# Altium schematic sheet 21_Peripherals.SchDoc: Peripherals
size A3; Organization: Lime Microsystems; Address1: Surrey Tech Centre; Address2: Guildford GU2 7YG; Address3: Surray; Address4: United Kingdom; Revision: v1.1; SheetNumber: 21; SheetTotal: 31
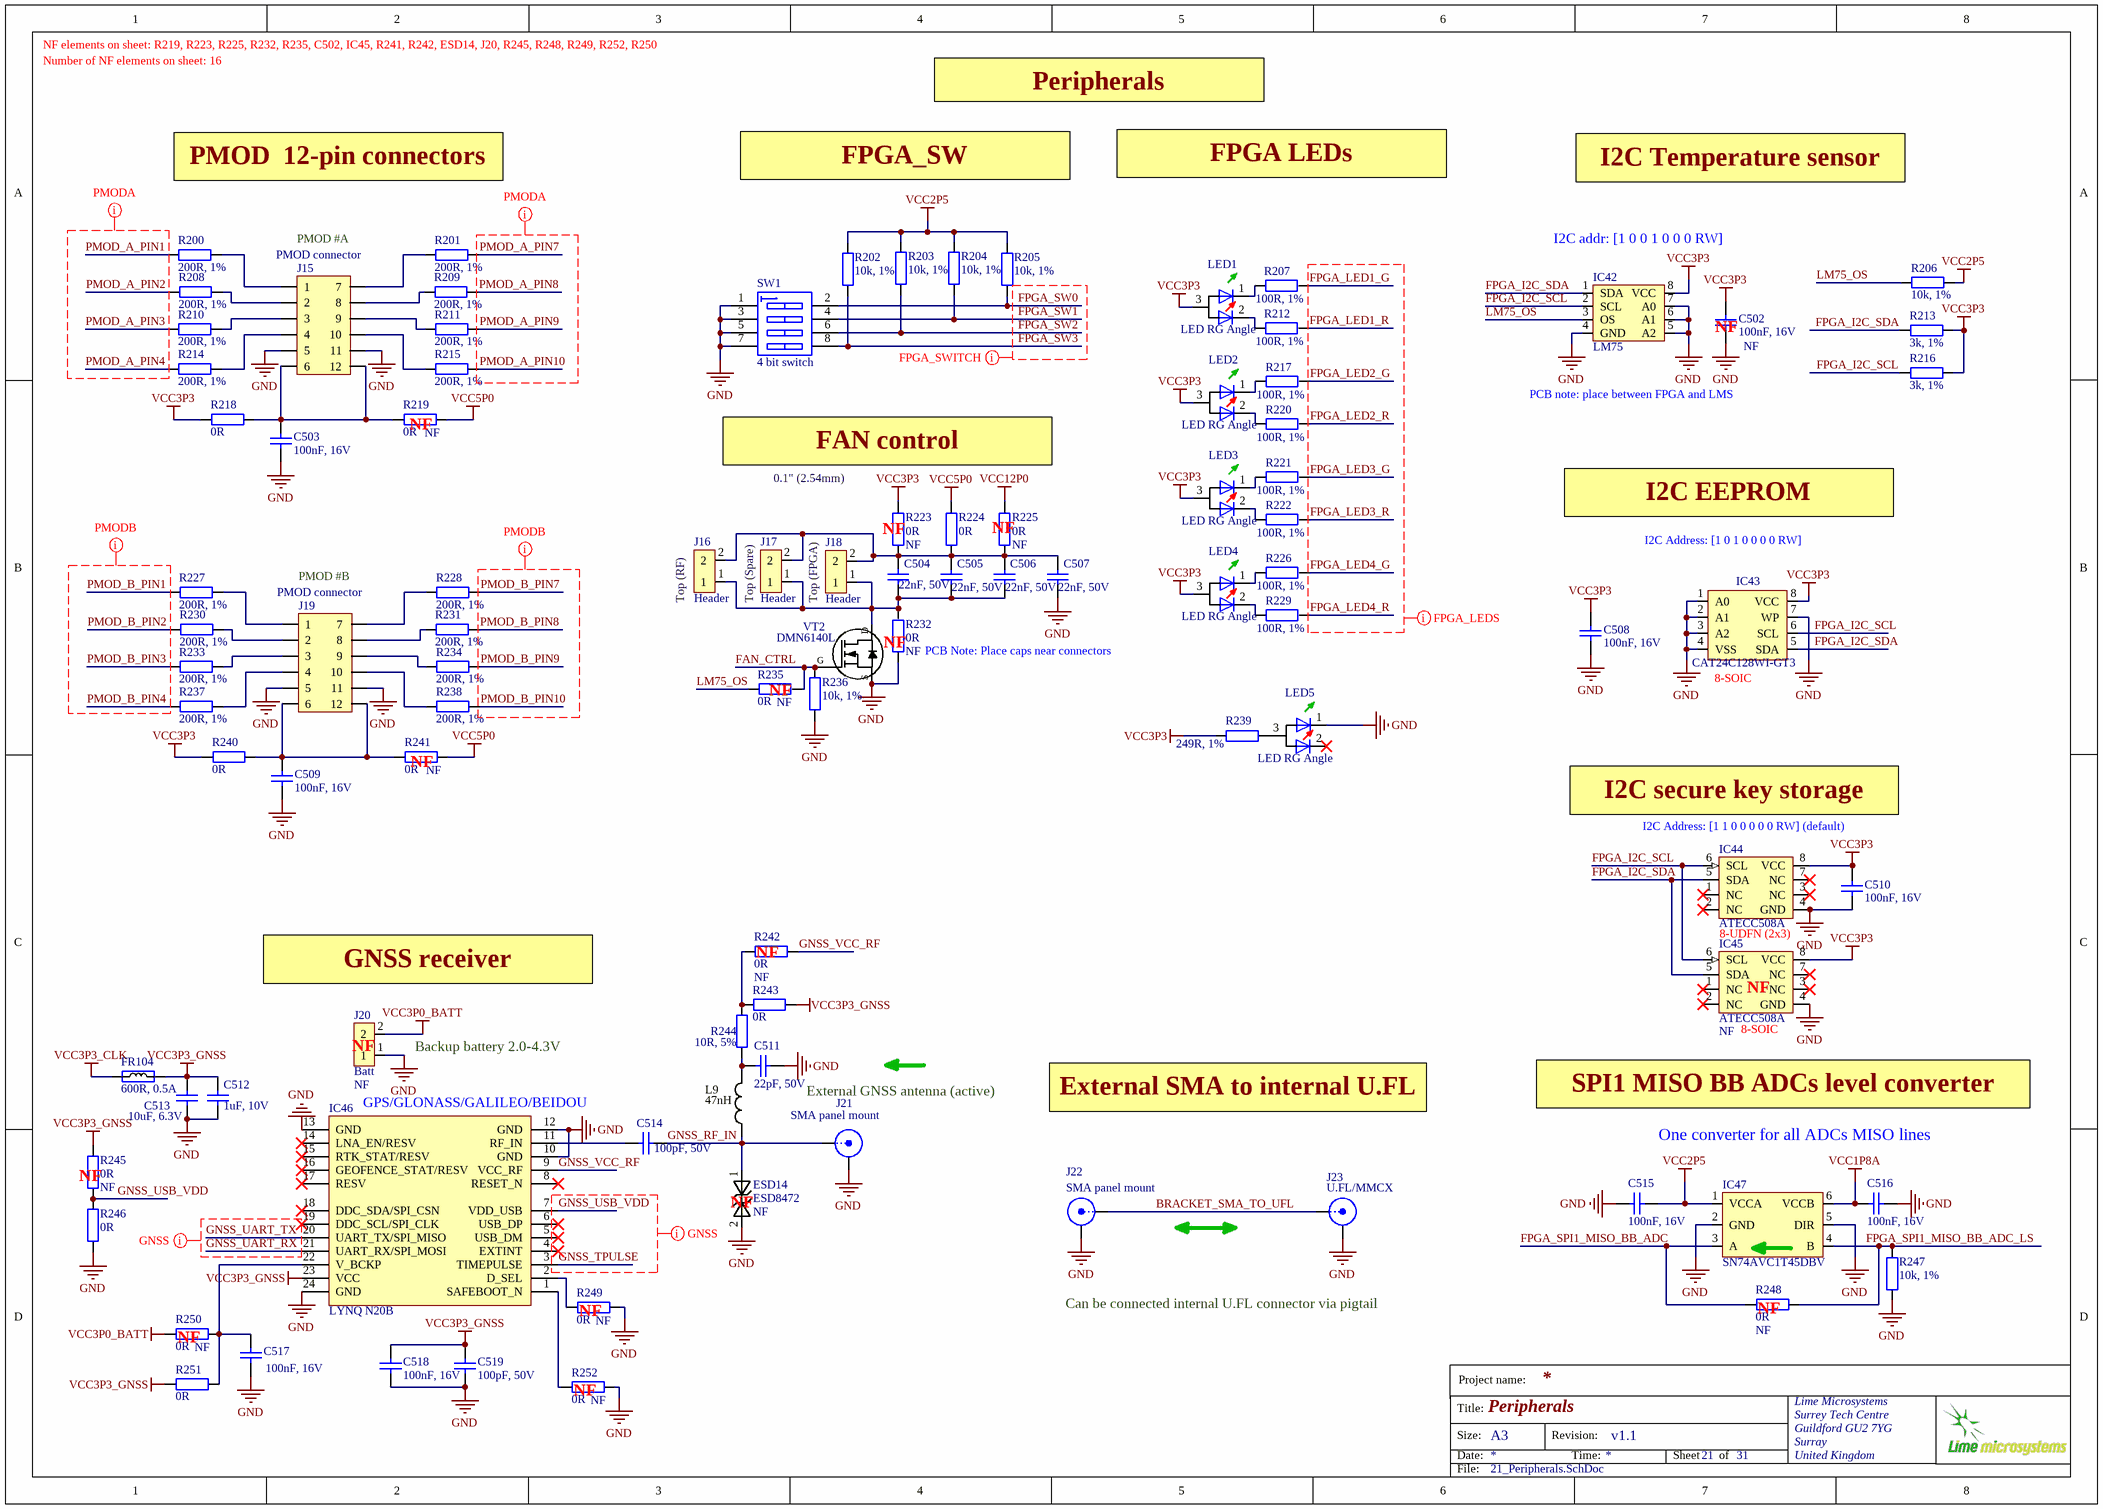
[diagram p0: 21_Peripherals.SchDoc]

## Parts
C502  100nF, 16V  Assembly Info: NF  [CAP0402]
C503  100nF, 16V  [CAP0402]
C504  22nF, 50V  [CAP0402]
C505  22nF, 50V  [CAP0402]
C506  22nF, 50V  [CAP0402]
C507  22nF, 50V  [CAP0402]
C508  100nF, 16V  [CAP0402]
C509  100nF, 16V  [CAP0402]
C510  100nF, 16V  [CAP0402]
C511  22pF, 50V  [CAP0402]
C512  1uF, 10V  [CAP0402]
C513  10uF, 6.3V  [CAP0603]
C514  100pF, 50V  [CAP0402]
C515  100nF, 16V  [CAP0402]
C516  100nF, 16V  [CAP0402]
C517  100nF, 16V  [CAP0402]
C518  100nF, 16V  [CAP0402]
C519  100pF, 50V  [CAP0402]
ESD14  ESD8472  Assembly Info: NF  [ESD8472_X3DFN2]
FR104  value 600R, 0.5A  [RES0402]  (hidden comment: Ferrite)
IC42  LM75  [HWSON8_LM75]
IC43  CAT24C128WI-GT3  [SOIC127P600-8DL_v2]
IC44  ATECC508A  [ATECC508A_UDFN8]
IC45  ATECC508A  Assembly Info: NF  [SOIC127P600-8DL_v2]
IC46  LYNQ N20B  [NEO-7M/8M]
IC47  SN74AVC1T45DBV  [SOT23-6]
J15  PMOD connector  [PMODconn_right_angle_TH]
J16  Header  [HDR_1x2]
J17  Header  [HDR_1x2]
J18  Header  [HDR_1x2]
J19  PMOD connector  [PMODconn_right_angle_TH]
J20  Batt  Assembly Info: NF  [HDR_1x2]
J21  SMA panel mount  [SMA_connector_side]
J22  SMA panel mount  [SMA_connector_side]
J23  U.FL/MMCX  [MMCX_UFL_conn_u]
L9  47nH  [RES0402]
LED1  LED RG Angle  [LED_RG_RIGHT_ANGLE_v3]
LED2  LED RG Angle  [LED_RG_RIGHT_ANGLE_v3]
LED3  LED RG Angle  [LED_RG_RIGHT_ANGLE_v3]
LED4  LED RG Angle  [LED_RG_RIGHT_ANGLE_v3]
LED5  LED RG Angle  [LED_RG_RIGHT_ANGLE_v3]
R200  200R, 1%  [RES0402]
R201  200R, 1%  [RES0402]
R202  10k, 1%  [RES0402]
R203  10k, 1%  [RES0402]
R204  10k, 1%  [RES0402]
R205  10k, 1%  [RES0402]
R206  10k, 1%  [RES0402]
R207  100R, 1%  [RES0402]
R208  200R, 1%  [RES0402]
R209  200R, 1%  [RES0402]
R210  200R, 1%  [RES0402]
R211  200R, 1%  [RES0402]
R212  100R, 1%  [RES0402]
R213  3k, 1%  [RES0402]
R214  200R, 1%  [RES0402]
R215  200R, 1%  [RES0402]
R216  3k, 1%  [RES0402]
R217  100R, 1%  [RES0402]
R218  0R  [RES0402]
R219  0R  Assembly Info: NF  [RES0402]
R220  100R, 1%  [RES0402]
R221  100R, 1%  [RES0402]
R222  100R, 1%  [RES0402]
R223  0R  Assembly Info: NF  [RES0402]
R224  0R  [RES0402]
R225  0R  Assembly Info: NF  [RES0402]
R226  100R, 1%  [RES0402]
R227  200R, 1%  [RES0402]
R228  200R, 1%  [RES0402]
R229  100R, 1%  [RES0402]
R230  200R, 1%  [RES0402]
R231  200R, 1%  [RES0402]
R232  0R  Assembly Info: NF  [RES0402]
R233  200R, 1%  [RES0402]
R234  200R, 1%  [RES0402]
R235  0R  Assembly Info: NF  [RES0402]
R236  10k, 1%  [RES0402]
R237  200R, 1%  [RES0402]
R238  200R, 1%  [RES0402]
R239  249R, 1%  [RES0402]
R240  0R  [RES0402]
R241  0R  Assembly Info: NF  [RES0402]
R242  0R  Assembly Info: NF  [RES0402]
R243  0R  [RES0402]
R244  10R, 5%  [RES0402]
R245  0R  Assembly Info: NF  [RES0402]
R246  0R  [RES0402]
R247  10k, 1%  [RES0402]
R248  0R  Assembly Info: NF  [RES0402]
R249  0R  Assembly Info: NF  [RES0402]
R250  0R  Assembly Info: NF  [RES0402]
R251  0R  [RES0402]
R252  0R  Assembly Info: NF  [RES0402]
SW1  4 bit switch  [DS02C-254-1L-04BE_DIP_SWITCH_4PIN]
VT2  DMN6140L  [SOT23-3]

## Nets
GND: C502.2 C503.2 C507.2 C508.2 C509.2 C510.2 C511.1 C512.1 C513.1 C515.1 C516.2 C517.2 C518.1 C519.2 ESD14.2 IC42.4(GND) IC42.5(A2) IC42.6(A1) IC42.7(A0) IC43.1(A0) IC43.2(A1) IC43.3(A2) IC43.4(VSS) IC43.7(WP) IC44.4(GND) IC45.4(GND) IC46.10(GND) IC46.12(GND) IC46.13(GND) IC46.24(GND) IC47.2(GND) IC47.5(DIR) J15.5 J15.11 J19.5 J19.11 J20.1 J21.2(Y) J22.2(Y) J23.2(Y) LED5.1(C1) R232.1 R236.2 R246.2 R247.1 R249.1 R252.1 SW1.1(A1) SW1.3(A2) SW1.5(A3) SW1.7(A4) VT2.S
VCC1P8A: C516.1 IC47.6(VCCB)
VCC2P5: C515.2 IC47.1(VCCA) R202.1 R203.1 R204.1 R205.1 R206.2
VCC3P0_BATT: J20.2 R250.2
VCC3P3: C502.1 C508.1 C510.1 IC42.8(VCC) IC43.8(VCC) IC44.8(VCC) IC45.8(VCC) LED1.3(A) LED2.3(A) LED3.3(A) LED4.3(A) R213.1 R216.1 R218.2 R223.2 R239.1 R240.2
VCC3P3_CLK: FR104.1
VCC3P3_GNSS: C512.2 C513.2 C518.2 C519.1 FR104.2 IC46.23(VCC) R243.1 R245.2 R251.2
VCC5P0: R219.1 R224.2 R241.1
VCC12P0: R225.2
BRACKET_SMA_TO_UFL: J22.1(X) J23.1(X)
FAN_CTRL: R235.2 R236.1 VT2.G
FPGA_I2C_SCL: IC42.2(SCL) IC43.6(SCL) IC44.6(SCL) IC45.6(SCL) R216.2
FPGA_I2C_SDA: IC42.1(SDA) IC43.5(SDA) IC44.5(SDA) IC45.5(SDA) R213.2
FPGA_LED1_G: R207.2
FPGA_LED1_R: R212.2
FPGA_LED2_G: R217.2
FPGA_LED2_R: R220.2
FPGA_LED3_G: R221.2
FPGA_LED3_R: R222.2
FPGA_LED4_G: R226.2
FPGA_LED4_R: R229.2
FPGA_SPI1_MISO_BB_ADC: IC47.3(A) R248.2
FPGA_SPI1_MISO_BB_ADC_LS: IC47.4(B) R247.2 R248.1
FPGA_SW0: R205.2 SW1.2(B1)
FPGA_SW1: R204.2 SW1.4(B2)
FPGA_SW2: R203.2 SW1.6(B3)
FPGA_SW3: R202.2 SW1.8(B4)
GNSS_RF_IN: C514.1 ESD14.1 J21.1(X) L9.1
GNSS_TPULSE: IC46.3(TIMEPULSE)
GNSS_UART_RX: IC46.21(UART_RX/SPI_MOSI)
GNSS_UART_TX: IC46.20(UART_TX/SPI_MISO)
GNSS_USB_VDD: IC46.7(VDD_USB) R245.1 R246.1
GNSS_VCC_RF: IC46.9(VCC_RF) R242.2
LM75_OS: IC42.3(OS) R206.1 R235.1
PMOD_A_PIN1: R200.1
PMOD_A_PIN2: R208.1
PMOD_A_PIN3: R210.1
PMOD_A_PIN4: R214.1
PMOD_A_PIN7: R201.2
PMOD_A_PIN8: R209.2
PMOD_A_PIN9: R211.2
PMOD_A_PIN10: R215.2
PMOD_B_PIN1: R227.1
PMOD_B_PIN2: R230.1
PMOD_B_PIN3: R233.1
PMOD_B_PIN4: R237.1
PMOD_B_PIN7: R228.2
PMOD_B_PIN8: R231.2
PMOD_B_PIN9: R234.2
PMOD_B_PIN10: R238.2
NetC503_1: C503.1 J15.6 J15.12 R218.1 R219.2
NetC504_1: C504.1 C505.1 C506.1 C507.1 J16.2 J17.2 J18.2 R223.1 R224.1 R225.1
NetC504_2: C504.2 C505.2 C506.2 J16.1 J17.1 J18.1 R232.2 VT2.D
NetC509_1: C509.1 J19.6 J19.12 R240.1 R241.2
NetC511_2: C511.2 L9.2 R244.2
NetC514_2: C514.2 IC46.11(RF_IN)
NetC517_1: C517.1 IC46.22(V_BCKP) R250.1 R251.1
NetIC46_1: IC46.1(SAFEBOOT_N) R252.2
NetIC46_2: IC46.2(D_SEL) R249.2
NetJ15_1: J15.1 R200.2
NetJ15_2: J15.2 R208.2
NetJ15_3: J15.3 R210.2
NetJ15_4: J15.4 R214.2
NetJ15_7: J15.7 R201.1
NetJ15_8: J15.8 R209.1
NetJ15_9: J15.9 R211.1
NetJ15_10: J15.10 R215.1
NetJ19_1: J19.1 R227.2
NetJ19_2: J19.2 R230.2
NetJ19_3: J19.3 R233.2
NetJ19_4: J19.4 R237.2
NetJ19_7: J19.7 R228.1
NetJ19_8: J19.8 R231.1
NetJ19_9: J19.9 R234.1
NetJ19_10: J19.10 R238.1
NetLED1_1: LED1.1(C1) R207.1
NetLED1_2: LED1.2(C2) R212.1
NetLED2_1: LED2.1(C1) R217.1
NetLED2_2: LED2.2(C2) R220.1
NetLED3_1: LED3.1(C1) R221.1
NetLED3_2: LED3.2(C2) R222.1
NetLED4_1: LED4.1(C1) R226.1
NetLED4_2: LED4.2(C2) R229.1
NetLED5_3: LED5.3(A) R239.2
NetR242_1: R242.1 R243.2 R244.1

Not connected (* = marked no-connect by the designer): IC44 1(NC)* 2(NC)* 3(NC)* 7(NC)*; IC45 1(NC)* 2(NC)* 3(NC)* 7(NC)*; IC46 4(EXTINT)* 5(USB_DM)* 6(USB_DP)* 8(RESET_N)* 14(LNA_EN/RESV)* 15(RTK_STAT/RESV)* 16(GEOFENCE_STAT/RESV)* 17(RESV)* 18(DDC_SDA/SPI_CSN)* 19(DDC_SCL/SPI_CLK)*; LED5 2(C2)*

## Layout directives
net class FPGA_LEDS: FPGA_LED1_G, FPGA_LED1_R, FPGA_LED2_G, FPGA_LED2_R, FPGA_LED3_G, FPGA_LED3_R, FPGA_LED4_G, FPGA_LED4_R
net class GNSS: GNSS_TPULSE, GNSS_UART_RX, GNSS_UART_TX, GNSS_USB_VDD
net class FPGA_SWITCH: FPGA_SW0, FPGA_SW1, FPGA_SW2, FPGA_SW3
net class PMODB: PMOD_B_PIN1, PMOD_B_PIN2, PMOD_B_PIN3, PMOD_B_PIN4, PMOD_B_PIN7, PMOD_B_PIN8, PMOD_B_PIN9, PMOD_B_PIN10
net class PMODA: PMOD_A_PIN1, PMOD_A_PIN2, PMOD_A_PIN3, PMOD_A_PIN4, PMOD_A_PIN7, PMOD_A_PIN8, PMOD_A_PIN9, PMOD_A_PIN10

## Notes on the sheet
- Number of NF elements on sheet: 16
- NF elements on sheet: R219, R223, R225, R232, R235, C502, IC45, R241, R242, ESD14, J20, R245, R248, R249, R252, R250
- Peripherals
- PMOD  12-pin connectors
- FPGA_SW
- FPGA LEDs
- I2C Temperature sensor
- (near J15) PMOD #A
- I2C addr: [1 0 0 1 0 0 0 RW]
- (near C502) NF
- (near R219) NF
- PCB note: place between FPGA and LMS
- FAN control
- 0.1" (2.54mm)
- I2C EEPROM
- (near J19) PMOD #B
- (near R223) NF
- (near R225) NF
- (near IC43) I2C Address: [1 0 1 0 0 0 0 RW]
- (near J16) Top (RF)
- Top (Spare)
- Top (FPGA)
- NF
- (near R232) PCB Note: Place caps near connectors
- (near R235) NF
- (near IC43) 8-SOIC
- (near R241) NF
- I2C secure key storage
- I2C Address: [1 1 0 0 0 0 0 RW] (default)
- (near J20) GNSS receiver
- (near R242) NF
- 8-UDFN (2x3)
- (near IC45) NF
- (near J20) NF
- (near J20) Backup battery 2.0-4.3V
- (near IC45) 8-SOIC
- (near IC46) GPS/GLONASS/GALILEO/BEIDOU
- External GNSS antenna (active)
- External SMA to internal U.FL
- SPI1 MISO BB ADCs level converter
- (near R245) NF
- One converter for all ADCs MISO lines
- (near ESD14) NF
- (near R249) NF
- Can be connected internal U.FL connector via pigtail
- (near R248) NF
- (near R250) NF
- (near R252) NF
- Project name:
- Title:
- Size:
- Date:
- A3
- Revision:
- Time:
- Sheet
- of
- File:

## Library data of the parts
C502 C503 C508-C510 C517 = Cap_0603: Manufacturer Part Number 1: GRM155R71C104KA88D; Part Description: 0.10µF ±10% 16V X7R Ceramic Capacitor -55°C ~ 125°C Surface Mount, MLCC 0402 (1005 Metric) 0.039" L x 0.020" W (1.00mm x 0.50mm); Brand: Murata Electronics; Tolerance: 10 %; Type: General Purpose MLCC; Capacitance: 0.1 uF; Temperature Coefficient / Code: +/- 15 %; Case Height: 0.5 mm; Case Length: 1 mm; Dielectric: X7R; Supplier 1: Mouser; Supplier Part Number 1: 81-GRM155R71C104KA88; Case Code - in: 0402; Manufacturer: Murata Electronics; Category: Multilayer Ceramic Capacitors MLCC - SMD/SMT; Voltage Rating DC: 16 V; Value: 100nF, 16V; Case Code - mm: 1005; Case Width: 0.5 mm; Maximum Operating Temperature: + 125 C; Minimum Operating Temperature: - 55 C; Minimum Order Quantity: 1; Operating Temperature Range: - 55 C to + 125 C; Package / Case: 0402 (1005 metric); Packaging: Reel; Product: General Type MLCCs; Product Category: Low & Medium Capacitance SMD Ceramic Chip Capacitors; Reeling: True; RoHS - Mouser: Y; RoHS: RoHS Compliant; Series: GRM; Standard Pack Qty: 10000; Termination Style: SMD/SMT
  C503 C509 C517: Manufacturer Part Number: GRM155R71C104KA88D
C504-C507 = Cap_0402: Manufacturer: Kemet; Manufacturer Part Number 1: C0402C223K5RACTU; Part Description: 0.022µF ±10% 50V Ceramic Capacitor X7R 0402 (1005 Metric); Temperature Coefficient: X7R; Tolerance: ±10%; Capacitance: 0.022µF; Value: 22nF, 50V; Supplier 1: Digi-Key; Supplier Part Number 1: 399-7780-1-ND; Ratings: -; Packaging: Cut Tape (CT); Category: Capacitors; Size / Dimension: 0.039" L x 0.020" W (1.00mm x 0.50mm); RoHS: RoHS Compliant; Operating Temperature: -55°C ~ 125°C; Mounting Type: Surface Mount, MLCC; Applications: General Purpose; Voltage - Rated: 50V; Thickness (Max): 0.022" (0.55mm); Features: -; Height - Seated (Max): -; Lead Style: -; Package / Case: 0402 (1005 Metric); Lead Spacing: -
C511 = Cap_0402: Manufacturer: Yageo; Manufacturer Part Number 1: CC0402JRNPO9BN220; Part Description: 22pF ±5% 50V C0G, NP0 Ceramic Capacitor -55°C ~ 125°C Surface Mount, MLCC 0402 (1005 Metric) 0.039" L x 0.020" W (1.00mm x 0.50mm); Tolerance: ±5%; Temperature Coefficient: C0G, NP0; Value: 22pF, 50V; Supplier 1: Digi-Key; Supplier Part Number 1: 311-1018-2-ND; Category: Capacitors; Voltage - Rated: 50V; Packaging: Tape & Reel (TR); RoHS: RoHS Compliant; Capacitance: 22pF; Operating Temperature: -55°C ~ 125°C; Mounting Type: Surface Mount, MLCC; Height - Seated (Max): -; Size / Dimension: 0.039" L x 0.020" W (1.00mm x 0.50mm); Ratings: -; Applications: General Purpose; Thickness (Max): 0.022" (0.55mm); Lead Spacing: -; Lead Style: -; Features: -; Package / Case: 0402 (1005 Metric)
C512 = Cap_0402: CAP CER 1UF 10V X5R 0402; Manufacturer: TDK; Part Description: 1µF ±10% 10V X5R Ceramic Capacitor -55°C ~ 85°C Surface Mount, MLCC 0402 (1005 Metric) 0.039" L x 0.020" W (1.00mm x 0.50mm); Manufacturer Part Number 1: C1005X5R1E105K050BC; Voltage Rating: 10; Capacitance: 1; Capacitance Tolerance: ± 10%; Ceramic Capacitor Case: 0402 [1005 Metric]; Dielectric Characteristic: X6; Product Range: TDK - C Series; Value: 1uF, 10V; Supplier 1: Digi-Key; Supplier Part Number 1: 445-9066-1-ND; RoHS: YES; MSL: -
C513 = Cap_0603: Manufacturer Part Number 1: CC0603MRX5R5BB106; Manufacturer: Yageo; Part Description: 10µF ±20% 6.3V X5R Ceramic Capacitor -55°C ~ 85°C Surface Mount, MLCC 0603 (1608 Metric) 0.063" L x 0.031" W (1.60mm x 0.80mm); Capacitance: 10µF; Tolerance: ±20%; Supplier 1: Digi-Key; Supplier Part Number 1: 311-1448-2-ND; Package / Case: 0603 (1608 Metric); Category: Capacitors; Voltage - Rated: 6.3V; Value: 10uF, 6.3V
C514 C519 = Cap_0402: Manufacturer Part Number 1: CC0402JRNPO9BN101; Manufacturer: Yageo; Part Description: 100pF ±5% 50V C0G, NP0 Ceramic Capacitor -55°C ~ 125°C Surface Mount, MLCC 0402 (1005 Metric) 0.039" L x 0.020" W (1.00mm x 0.50mm); Tolerance: ±5%; Temperature Coefficient: C0G, NP0; Value: 100pF, 50V; Capacitance: 100pF; Thickness (Max): 0.022" (0.55mm); Size / Dimension: 0.039" L x 0.020" W (1.00mm x 0.50mm); RoHS: RoHS Compliant; Ratings: -; Package / Case: 0402 (1005 Metric); Mounting Type: Surface Mount, MLCC; Height - Seated (Max): -; Features: -; Lead Spacing: -; Voltage - Rated: 50V; Operating Temperature: -55°C ~ 125°C; Packaging: Cut Tape (CT); Applications: General Purpose; Lead Style: -; Supplier 1: Digi-Key; Category: Capacitors; Supplier Part Number 1: 311-1024-1-ND
C515 C516 = Cap_0603: Part Description: 0.10µF ±10% 16V X7R Ceramic Capacitor -55°C ~ 125°C Surface Mount, MLCC 0402 (1005 Metric) 0.039" L x 0.020" W (1.00mm x 0.50mm); Manufacturer Part Number 1: GRM155R71C104KA88D; Brand: Murata Electronics; Tolerance: 10 %; Type: General Purpose MLCC; Capacitance: 0.1 uF; Temperature Coefficient / Code: +/- 15 %; Case Height: 0.5 mm; Case Length: 1 mm; Dielectric: X7R; Supplier 1: Mouser; Supplier Part Number 1: 81-GRM155R71C104KA88; Case Code - in: 0402; Manufacturer: Murata Electronics; Category: Multilayer Ceramic Capacitors MLCC - SMD/SMT; Voltage Rating DC: 16 V; Value: 100nF, 16V; Case Code - mm: 1005; Case Width: 0.5 mm; Maximum Operating Temperature: + 125 C; Minimum Operating Temperature: - 55 C; Minimum Order Quantity: 1; Operating Temperature Range: - 55 C to + 125 C; Package / Case: 0402 (1005 metric); Packaging: Reel; Product: General Type MLCCs; Product Category: Low & Medium Capacitance SMD Ceramic Chip Capacitors; Reeling: True; RoHS - Mouser: Y; RoHS: RoHS Compliant; Series: GRM; Standard Pack Qty: 10000; Termination Style: SMD/SMT
C518 = Cap_0402: Manufacturer: Murata Electronics; Manufacturer Part Number: GRM155R71C104KA88D; Part Description: 0.10µF ±10% 16V X7R Ceramic Capacitor -55°C ~ 125°C Surface Mount, MLCC 0402 (1005 Metric) 0.039" L x 0.020" W (1.00mm x 0.50mm); Tolerance: 10 %; Type: General Purpose MLCC; Capacitance: 0.1 uF; Case Length: 1 mm; Dielectric: X7R; Case Height: 0.5 mm; Temperature Coefficient / Code: +/- 15 %; Value: 100nF, 16V; Supplier 1: Mouser; Supplier Part Number 1: 81-GRM155R71C104KA88; Case Code - in: 0402; RoHS: RoHS Compliant; Operating Temperature Range: - 55 C to + 125 C; Series: GRM; Termination Style: SMD/SMT; Package / Case: 0402 (1005 metric); Voltage Rating DC: 16 V; Maximum Operating Temperature: + 125 C; Case Code - mm: 1005; Minimum Operating Temperature: - 55 C; Product Category: Low & Medium Capacitance SMD Ceramic Chip Capacitors; Packaging: Reel; Product: General Type MLCCs; Category: Multilayer Ceramic Capacitors MLCC - SMD/SMT; Brand: Murata Electronics; Case Width: 0.5 mm; RoHS - Mouser: Y; Standard Pack Qty: 10000; Minimum Order Quantity: 1; Reeling: True; Manufacturer Part Number 1: GRM155R71C104KA88D
ESD14 = ESD8472: Manufacturer: ON Semiconductor; Manufacturer Part Number: ESD8472MUT5G; Part Description: TVS DIODE 5.3VWM 14VC X3DFN2; Voltage - Reverse Standoff (Typ): 5.3V (Max); Voltage - Breakdown (Min): 7V; Voltage - Clamping (Max) @ Ipp: 14V; Current - Peak Pulse (10/1000µs): 3A (8/20µs); Power Line Protection: No; Capacitance @ Frequency: 0.2pF @ 1MHz; Supplier 1: Digi-Key; RoHS: RoHS Compliant; Category: Circuit Protection; Stock 1: 2295; Pricing 1: 1=0.39, 10=0.315, 100=0.2142, 500=0.16068, 1000=0.12051 (USD); Packaging: Cut Tape (CT); Part Status: Active; Type: Zener; Power - Peak Pulse: -; Applications: Automotive, RF Antenna; Operating Temperature: -55°C ~ 150°C (TJ); Mounting Type: Surface Mount; Package / Case: 2-XFDFN; Supplier Device Package: 2-X3DFN (0.62x0.32); ComponentLink1URL: http://www.onsemi.com/pub/Collateral/ESD8472-D.PDF; ComponentLink1Description: http://www.onsemi.com/pub/Collateral/ESD8472-D.PDF; Supplier Part Number 1: ESD8472MUT5GOSCT-ND; Manufacturer Part Number 1: ESD8472MUT5G
FR104 = Ferrite: Manufacturer: Murata; Manufacturer Part Number 1: BLM15AX601SN1D; Part Description: - Ferrite Bead 0402 (1005 Metric) 500mA 340mOhm; Tolerance: 25%; Impedance: 600R; Current Rating: 500mA; Number of Lines: 1; DC Resistance (DCR): 340mR; Test Frequency: 100MHz; Supplier 1: Digi-Key; Supplier Part Number 1: 490-5441-1-ND; Stock 1: 416370; Pricing 1: 1=0.1, 10=0.06, 25=0.0552, 50=0.0496, 100=0.0363, 250=0.0264, 500=0.0242, 1000=0.0209, 5000=0.0165 (USD); Case/Package: 0402; Number of Pins: 2; Case Code (Metric): 1005; Case Code (Imperial): 0402; Core Material: Ferrite; Material: Steel,Ferrite; Min Operating Temperature: -55°C; Max Operating Temperature: 125°C; Package Quantity: 1; Packaging: Tape and Reel; Series: BLM15AX_SN; Max Current Rating: 500mA; Termination: SMD/SMT; Max DC Current: 500mA; Number of Circuits: 1; DC Resistance-Max: 340mR; Length: 1mm; Width: 0.5mm; Height: 0.5mm; Depth: 0.5mm; REACH SVHC: No SVHC; Lead Free: Lead Free; RoHS Compliant: Yes; ComponentLink1URL: https://www.murata.com/en-us/products/productdata/8796740059166/ENFA0018.pdf?src-supplier=Digi-Key; ComponentLink1Description: https://www.murata.com/en-us/products/productdata/8796740059166/ENFA0018.pdf?src-supplier=Digi-Key; ComponentLink2URL: http://search.murata.co.jp/Ceramy/image/img/PDF/ENG/L0110S0100BLM15AX_SN.pdf?src-supplier=Future+Electronics; ComponentLink2Description: http://search.murata.co.jp/Ceramy/image/img/PDF/ENG/L0110S0100BLM15AX_SN.pdf?src-supplier=Future+Electronics; ComponentLink3URL: http://www.produktinfo.conrad.com/datenblaetter/1100000-1199999/001171675-da-01-en-CHIP_DROSSEL0402_600R_420MA_1_0X0_5MM.pdf?src-supplier=Conrad; ComponentLink3Description: http://www.produktinfo.conrad.com/datenblaetter/1100000-1199999/001171675-da-01-en-CHIP_DROSSEL0402_600R_420MA_1_0X0_5MM.pdf?src-supplier=Conrad; ComponentLink4URL: http://www.produktinfo.conrad.com/datenblaetter/1100000-1199999/001172169-da-01-en-DROSSEL_0402_600R_1_0X0_5MM_10000ST.pdf?src-supplier=Conrad; ComponentLink4Description: http://www.produktinfo.conrad.com/datenblaetter/1100000-1199999/001172169-da-01-en-DROSSEL_0402_600R_1_0X0_5MM_10000ST.pdf?src-supplier=Conrad
IC42 = LM75: Manufacturer: NXP Semiconductors; Manufacturer Part Number 1: LM75BTP,147; Part Description: SENSOR TEMPERATURE I2C 8HWSON; Sensing Temperature - Local: -55°C ~ 125°C; Output Type: I²C; Accuracy - Highest (Lowest): ±2°C (±3°C); Voltage - Supply: 2.8 V ~ 5.5 V; Test Condition: -25°C ~ 100°C (-55°C ~ 125°C); Sensor Type: Digital, Local; Resolution: 10 b; Supplier 1: Digi-Key; Operating Temperature: -55°C ~ 125°C; Features: Output Switch, Programmable Limit, Shutdown Mode; Supplier Device Package: 8-HWSON (2x3); Sensing Temperature - Remote: -; Category: Sensors, Transducers; Packaging: Tape & Reel (TR); RoHS: RoHS Compliant; Package / Case: 8-WFDFN Exposed Pad; Supplier Part Number 1: 568-9815-2-ND
IC43 = 24FC64F: Part Description: EEPROM Memory IC 128Kb (16K x 8) I²C 1MHz 400ns 8-SOIC; Manufacturer: ON Semiconductor; Memory Type: Non-Volatile; Memory Format: EEPROM; Memory Size: 128Kb (16K x 8); Write Cycle Time - Word, Page: 5ms; Memory Interface: I²C; Voltage - Supply: 1.8 V ~ 5.5 V; Supplier 1: Digi-Key; Supplier Part Number 1: CAT24C128WI-GT3CT-ND; Manufacturer Part Number 1: CAT24C128WI-GT3; RoHS: RoHS Compliant; Category: Integrated Circuits (ICs); Stock 1: 14804; Pricing 1: 1=0.31, 10=0.309, 100=0.2532, 500=0.24616, 1000=0.23956 (USD); Packaging: Cut Tape (CT); Part Status: Active; Technology: EEPROM; Operating Temperature: -40°C ~ 85°C (TA); Mounting Type: Surface Mount; Package / Case: 8-SOIC (0.154", 3.90mm Width); Supplier Device Package: 8-SOIC; Base Part Number: CAT24C128; ComponentLink1URL: http://www.onsemi.com/pub/Collateral/CAT24C128-D.PDF; ComponentLink1Description: http://www.onsemi.com/pub/Collateral/CAT24C128-D.PDF
IC44 = ATECC508A_authentication_IC: Manufacturer: Microchip; Manufacturer Part Number 1: ATECC508A-MAHDA-S; Part Description: Authentication Chip IC Networking and Communications 8-UDFN (2x3); Supplier 1: Digi-Key; Stock 1: 27941; Pricing 1: 1=0.73, 25=0.7064 (USD); Supplier Part Number 1: ATECC508A-MAHDA-SDKR-ND
IC45 = ATECC508A_authentication_IC: Manufacturer: Microchip Technology; Manufacturer Part Number 1: ATECC508A-SSHDA-T; Part Description: Authentication Chip IC Networking and Communications 8-SOIC; Type: Authentication Chip; Mounting Type: Surface Mount; Supplier Part Number 1: ATECC508A-SSHDA-TCT-ND; Applications: Networking and Communications; Category: Integrated Circuits (ICs); Supplier 1: Digi-Key; Base Part Number: ATECC508; RoHS: RoHS Compliant; Package / Case: 8-SOIC (0.154", 3.90mm Width); Packaging: Cut Tape (CT); Supplier Device Package: 8-SOIC; Part Status: Active
IC46 = NEO-M8P_M8M: GNSS engine for GPS/QZSS, GLONASS; Manufacturer: RF channe;; Part Description: GNSS engine for GPS/QZSS, GLONASS receiver; ComponentLink1URL: https://www.u-blox.com/en/product/neo-7-series; ComponentLink2Description: Datasheet; ComponentLink1Description: https://www.u-blox.com/en/product/neo-7-series; ComponentLink3URL: https://www.u-blox.com/sites/default/files/NEO-M8-FW3_DataSheet_(UBX-15031086).pdf; ComponentLink3Description: https://www.u-blox.com/sites/default/files/NEO-M8-FW3_DataSheet_(UBX-15031086).pdf; Supplier 1: Lime Microsystems; Supplier Part Number 1: LYNQ N20B; Manufacturer Part Number 1: LYNQ N20B; Value: LYNQ N20B
IC47 = SN74AVC1T45DBV: Manufacturer: Texas Instruments; Part Description: Voltage Level Translator Bidirectional 1 Circuit 1 Channel 500Mbps SOT-23-6; Manufacturer Part Number 1: SN74AVC1T45DBVR; Data Rate: 500Mbps; Voltage - Supply: 1.2 V ~ 3.6 V; Supplier 1: Digi-Key; Category: Integrated Circuits (ICs); Package / Case: SOT-23-6; Supplier Part Number 1: 296-19094-1-ND
J15 J19 = PMOD_connector: Header, 4-Pin, Dual row; Manufacturer: Sullins Connector Solutions; Part Description: 12 Position Header Connector 0.100" (2.54mm) Through Hole, Right Angle Gold; Manufacturer Part Number 1: PPPC062LJBN-RC; Row Spacing: 0.100" (2.54mm); Number of Positions Loaded: All; Number of Positions: 12; Supplier 1: Digi-Key; Mounting Type: Through Hole, Right Angle; Contact Finish: Gold; Features: -; Category: Connectors, Interconnects; Packaging: Bulk; RoHS: RoHS Compliant; Number of Rows: 2; Contact Finish Thickness: Flash; Pitch: 0.100" (2.54mm); Termination: Solder; Contact Type: Female Socket; Color: Black; Connector Type: Header; Fastening Type: -; Supplier Part Number 1: S5559-ND
J16-J18 = Jumper: Part Description: Connector Header Through Hole 2 position 0.100" (2.54mm); Manufacturer: Wurth Electronics; Manufacturer Part Number 1: 61300211121; Current Rating: 3A; Voltage Rating: 250V; Number of Positions: 2; Gender: Male; Connector Type: Male Pin; Pitch: 0.1inch; ComponentLink1URL: https://cdn.harwin.com/pdfs/60page148.pdf; ComponentLink1Description: https://cdn.harwin.com/pdfs/60page148.pdf; ComponentLink2URL: https://www.verical.com/server-webapp/html/getDatasheet?partID=384167; ComponentLink2Description: https://www.verical.com/server-webapp/html/getDatasheet?partID=384167; ComponentLink3URL: http://www.harwin.com/include/downloads/drawings/M20-996.PDF; ComponentLink3Description: http://www.harwin.com/include/downloads/drawings/M20-996.PDF; Supplier 1: Digi-Key; Supplier Part Number 1: 732-5315-ND; Stock 1: 145436; Pricing 1: 1=0,13000, 10=0,10600, 25=0,08800, 50=0,07400, 100=0,06700, 1000=0,06100 (USD); RoHS: Yes; Mount: Through Hole; Contact Plating: Gold; Housing Material: PBT; Contact Material: Copper Alloy,Copper; Color: Black; Min Operating Temperature: -40°C; Max Operating Temperature: 125°C; Number of Rows: 1; Contact Gender: Male; Packaging: Bulk; Termination: Through Hole; Number of Contacts: 2; Contact Mating Length: 0.236inch; REACH SVHC: Unknown; Lead Free: Lead Free; ComponentLink4URL: https://datasheet.ciiva.com/13619/6130xx11121-48870-13619345.pdf?src-supplier=Mouser; ComponentLink4Description: https://datasheet.ciiva.com/13619/6130xx11121-48870-13619345.pdf?src-supplier=Mouser
J20 = Jumper: Manufacturer Part Number 1: 961102-6404-AR; Part Description: 2 Positions Header, Unshrouded Connector 0.100" (2.54mm) Through Hole Gold; Manufacturer: 3M; Connector Type: Header, Unshrouded; Supplier 1: Digi-Key; Supplier Part Number 1: 3M9447-ND; Contact Type: Male Pin; Color: Black; Mounting Type: Through Hole; Category: Connectors, Interconnects; Contact Finish: Gold
J21 J22 = RF_IF_connector: CONN SMA JACK STR 50OHM EDGE MNT; Manufacturer: Linx; Manufacturer Part Number 1: CONSMA002-L-G; Part Description: SMA Connector Receptacle, Female Socket 50Ohm Panel Mount, Through Hole, Right Angle Solder; Supplier 1: Digi-Key; Supplier Part Number 1: CONSMA002-L-G-ND; Stock 1: 815; Pricing 1: 1=4.08, 25=3.67, 100=3.32, 250=3.25, 500=3, 1000=2.80001, 2000=2.5875 (USD)
J23 = RF_IF_connector: CONN UMC RCPT STR 50 OHM SMD; Manufacturer: Molex, LLC; Manufacturer Part Number 1: 0734120110; Body Finish: Nickel; Body Material: Phosphor Bronze; Center Contact Material: Brass; Center Contact Plating: Gold; Connector Style: Ultra Miniature Coaxial; Connector Type: Jack, Male Pin; Contact Termination: Solder; Dielectric Material: Liquid Crystal Polymer (LCP); Frequency - Max: 6GHz; Impedance: 50 Ohm; Voltage Rating: 60V; Cable Group: -; Category: Connectors, Interconnects; Fastening Type: Snap-On; Features: -; Housing Color: Silver; Ingress Protection: -; Mounting Type: Surface Mount; Operating Temperature: -40°C ~ 90°C; Packaging: Cut Tape (CT); RoHS: RoHS Compliant; Shield Termination: Solder; Supplier 1: Digi-Key; Supplier Part Number 1: WM5587CT-ND; Part Description: CONN UMC RCPT STR 50 OHM SMD
L9 = Inductor_0603: Manufacturer: COILCRAFT; Manufacturer Part Number: 0402HP-47NXJLU; Part Description: INDUCTOR, RF, 47NH, 5%, 2.4GHZ, SMD; Product Range:0402HP Series; Inductance:47nH; Inductance Tolerance:± 5%; High Frequency Inductor Case:0402 [1005 Metric]; Self Resonant Frequency Min:2.4GHz; DC Resistance Max:0.58ohm; DC Current Rating:420mA; SVHC: No SVHC (15-Jun-2015); Inductance Tolerance: ± 5%; High Frequency Inductor Case: 0402 [1005 Metric]; Inductance: 47; DC Resistance Max: 0.58; Self Resonant Frequency Min: 2.4; Product Range: 0402; DC Current Rating: 420; Inductor Construction: Wirewound; Supplier 1: Farnell; Supplier Part Number 1: 2285856; Packaging: Cut Tape; Inductor Case Style: 0402 [1005 Metric]; RoHS: Y-EX; value: 47nH; Manufacturer Part Number 1: 0402HP-47NXJLU
LED1-LED5 = LED_green_red_right_angle_v2: Part Description: Green, Red 572nm Green, 647nm Red LED Indication - Discrete 2.1V Green, 1.7V Red 2-SMD, No Lead; Manufacturer: Stanley Electric; Manufacturer Part Number 1: BRPY1211FTR; Color: Green,Red; Lens Color: White; Viewing Angle: 143°; Forward Voltage: 1.7V; Lens Style: Colorless; Wavelength: 570nm; Reverse Breakdown Voltage: 4V; Forward Current: 25mA; Dominant Wavelength: 647nm; Luminous Intensity: 17.6mcd; Test Current: 20mA; Lens Transparency: Diffused; Number of Elements: 2; Power Dissipation: 70mW; Supplier 1: Arrow Electronics; Supplier Part Number 1: BRPY1211F-TR; Stock 1: 0; RoHS: Yes; Mount: Surface Mount; Case/Package: SMD/SMT; Number of Pins: 3; Min Operating Temperature: -40°C; Max Operating Temperature: 85°C; Packaging: Tape and Reel; Package Quantity: 3000; Reverse Voltage: 4V; Length: 3mm; Width: 2mm; Height: 1.15mm; Depth: 2mm; Radiation Hardening: No; Lead Free: Lead Free; ComponentLink1URL: https://datasheet.ciiva.com/2114/1211f-e-2114386.pdf?src-supplier=Digi-Key; ComponentLink1Description: https://datasheet.ciiva.com/2114/1211f-e-2114386.pdf?src-supplier=Digi-Key
R200 R201 R208-R211 R214 R215 R227 R228 R230 R231 R233 R234 R237 R238 = Res_0402: Part Description: 200 ±1% 0.063W, 1/16W Chip Resistor 0402 (1005 Metric) Moisture Resistant Thick Film; Manufacturer: Yageo; Manufacturer Part Number 1: RC0402FR-07200RL; Power Rating: 63mW; Voltage Rating: 50V; Temperature Coefficient: 100ppm/°C; Value: 200R, 1%; Supplier 1: Digi-Key; Supplier Part Number 1: 311-200LRCT-ND; Stock 1: 4229680; Pricing 1: 1=0,10000, 10=0,01600, 100=0,00660, 1000=0,00299, 2500=0,00259, 5000=0,00214 (USD); RoHS: Yes; Case/Package: 0402; Case Code (Metric): 1005; Case Code (Imperial): 0402; Size Code: 0402; Min Operating Temperature: -55°C; Max Operating Temperature: 155°C; Resistance: 200R; Tolerance: 1%; Packaging: Tape and Reel; Package Quantity: 1; Resistor Type: Thick Film; Number of Terminations: 2; Termination: SMD/SMT; Max Power Dissipation: 63mW; Voltage Rating (DC): 50V; Features: Moisture Resistant; Series: RC; Construction: Rectangular; Resistance Tolerance: 1%; Length: 1mm; Width: 0.02inch; Height: 0.016inch; Depth: 0.5mm; REACH SVHC: No SVHC; Military Standard: Not; Lead Free: Lead Free; RoHS Compliant: Yes; ComponentLink1URL: https://datasheet.ciiva.com/2553/pyu-r-int-thick-7-2553232.pdf?src-supplier=Digi-Key; ComponentLink1Description: https://datasheet.ciiva.com/2553/pyu-r-int-thick-7-2553232.pdf?src-supplier=Digi-Key; ComponentLink2URL: https://datasheet.ciiva.com/7983/1018594-7983509.pdf?src-supplier=Element14; ComponentLink2Description: https://datasheet.ciiva.com/7983/1018594-7983509.pdf?src-supplier=Element14; ComponentLink3URL: https://datasheet.ciiva.com/16804/pyu-rc0402-51-rohs-l-6-r-16804406.pdf?src-supplier=Future+Electronics; ComponentLink3Description: https://datasheet.ciiva.com/16804/pyu-rc0402-51-rohs-l-6-r-16804406.pdf?src-supplier=Future+Electronics; ComponentLink4URL: https://datasheet.ciiva.com/15189/getdatasheetpartid-331152-15189383.pdf?src-supplier=Verical; ComponentLink4Description: https://datasheet.ciiva.com/15189/getdatasheetpartid-331152-15189383.pdf?src-supplier=Verical; ComponentLink5URL: https://datasheet.ciiva.com/7849/1018594-7849898.pdf?src-supplier=Element14; ComponentLink5Description: https://datasheet.ciiva.com/7849/1018594-7849898.pdf?src-supplier=Element14; ComponentLink6URL: https://datasheet.ciiva.com/5562/pyu-rc0402-51-rohs-l-6-r-8721-5562539.pdf?src-supplier=Mouser; ComponentLink6Description: https://datasheet.ciiva.com/5562/pyu-rc0402-51-rohs-l-6-r-8721-5562539.pdf?src-supplier=Mouser; ComponentLink7URL: https://datasheet.ciiva.com/7849/1018594-7849899.pdf?src-supplier=Element14; ComponentLink7Description: https://datasheet.ciiva.com/7849/1018594-7849899.pdf?src-supplier=Element14; ComponentLink8URL: https://datasheet.ciiva.com/2553/pyu-r-int-thick-7-2553230.pdf?src-supplier=Digi-Key; ComponentLink8Description: https://datasheet.ciiva.com/2553/pyu-r-int-thick-7-2553230.pdf?src-supplier=Digi-Key; ComponentLink9URL: https://datasheet.ciiva.com/2553/pyu-r-int-thick-7-2553231.pdf?src-supplier=Digi-Key; ComponentLink9Description: https://datasheet.ciiva.com/2553/pyu-r-int-thick-7-2553231.pdf?src-supplier=Digi-Key
R202-R206 R236 R247 = Res_0402: Manufacturer: Yageo; Manufacturer Part Number 1: RC0402FR-0710KL; Part Description: RES SMD 10K OHM 1% 1/16W 0402; Temperature Coefficient: ±100ppm/°C; Power (Watts): 0.063W, 1/16W; Value: 10k, 1%; Supplier 1: Digi-Key; Supplier Part Number 1: 311-10.0KLRTR-ND; Resistance (Ohms): 10k; Packaging: Tape & Reel (TR); RoHS: RoHS Compliant; Package / Case: 0402 (1005 Metric); Tolerance: ±1%; Operating Temperature: -55°C ~ 155°C; Size / Dimension: 0.039" L x 0.020" W (1.00mm x 0.50mm); Number of Terminations: 2; Category: Resistors; Height: 0.016" (0.40mm); Supplier Device Package: 0402; Features: Moisture Resistant; Composition: Thick Film
R207 R212 R217 R220-R222 R226 R229 = Res_0402: Manufacturer Part Number 1: RMCF0402FT100R; Manufacturer: Stackpole Electronics Inc.; Part Description: RES SMD 100 OHM 1% 1/16W 0402; Power (Watts): 0.063W, 1/16W; Temperature Coefficient: ±100ppm/°C; Resistance (Ohms): 100; Value: 100R, 1%; Supplier 1: Digi-Key; Supplier Part Number 1: RMCF0402FT100RDKR-ND; Packaging: Digi-Reel®; Composition: Thick Film; Number of Terminations: 2; Package / Case: 0402 (1005 Metric); RoHS: RoHS Compliant; Category: Resistors; Size / Dimension: 0.039" L x 0.020" W (1.00mm x 0.50mm); Tolerance: ±1%; Supplier Device Package: 0402; Features: -; Height: 0.016" (0.40mm); Operating Temperature: -55°C ~ 155°C
R213 R216 = Res_0402: Manufacturer: Vishay Dale; Part Description: RES SMD 3K OHM 1% 1/16W 0402; Manufacturer Part Number 1: CRCW04023K00FKED; Temperature Coefficient: ±100ppm/°C; Power (Watts): 0.063W, 1/16W; Value: 3k, 1%; Category: Resistors; Tolerance: ±1%; RoHS: RoHS Compliant; Composition: Thick Film; Number of Terminations: 2; Operating Temperature: -55°C ~ 155°C; Supplier Device Package: 0402 (1005 Metric); Supplier Part Number 1: 541-3.00KLCT-ND; Packaging: Cut Tape (CT); Supplier 1: Digi-Key; Package / Case: 0402 (1005 Metric); Features: Automotive AEC-Q200; Resistance (Ohms): 3k; Height: 0.016" (0.40mm); Size / Dimension: 0.039" L x 0.020" W (1.00mm x 0.50mm)
R218 R219 R235 R240 R241 = Res_0402: Manufacturer: Yageo; Part Description: RES SMD 0.0OHM JUMPER 1/16W 0402; Manufacturer Part Number 1: RC0402JR-070RL; Supplier 1: Digi-Key; Supplier Part Number 1: 311-0.0JRTR-ND; Composition: Thick Film; Package / Case: 0402 (1005 Metric); Category: Resistors; Value: 0R
R223-R225 R232 R242 R243 R245 R246 R248-R252 = Res_0402: Manufacturer Part Number 1: RC0402JR-070RL; Manufacturer: Yageo; Part Description: RES SMD 0.0OHM JUMPER 1/16W 0402; Resistance (Ohms): 0.0; Tolerance: Jumper; Power (Watts): 0.063W, 1/16W; Value: 0R; Supplier 1: Digi-Key; Supplier Part Number 1: 311-0.0JRTR-ND; Category: Resistors; Temperature Coefficient: -; Features: Moisture Resistant; Supplier Device Package: 0402; Height: 0.016" (0.40mm); Package / Case: 0402 (1005 Metric); Operating Temperature: -55°C ~ 155°C; Size / Dimension: 0.039" L x 0.020" W (1.00mm x 0.50mm); Composition: Thick Film; Packaging: Tape & Reel (TR); Number of Terminations: 2; RoHS: RoHS Compliant
R239 = Res_0402: Manufacturer Part Number 1: RMCF0402FT249R; Manufacturer: Stackpole Electronics Inc; Part Description: RES SMD 249 OHM 1% 1/16W 0402; Resistance (Ohms): 249; Power (Watts): 0.063W, 1/16W; Temperature Coefficient: ±100ppm/°C; Value: 249R, 1%; Supplier 1: Digi-Key; Supplier Part Number 1: RMCF0402FT249RCT-ND; Package / Case: 0402 (1005 Metric); Features: -; Size / Dimension: 0.039" L x 0.020" W (1.00mm x 0.50mm); Category: Resistors; Operating Temperature: -55°C ~ 155°C; Packaging: Cut Tape (CT); Tolerance: ±1%; Supplier Device Package: 0402; RoHS: RoHS Compliant; Composition: Thick Film; Number of Terminations: 2; Height: 0.016" (0.40mm)
R244 = Res_0402: Manufacturer Part Number 1: RC0402JR-0710RL; Manufacturer: Yageo; Part Description: RES SMD 10 OHM 5% 1/16W 0402; Power (Watts): 0.063W, 1/16W; Resistance (Ohms): 10; Temperature Coefficient: ±200ppm/°C; Value: 10R, 5%; Supplier 1: Digi-Key; Supplier Part Number 1: 311-10JRTR-ND; Number of Terminations: 2; Height: 0.016" (0.40mm); RoHS: RoHS Compliant; Composition: Thick Film; Packaging: Tape & Reel (TR); Category: Resistors; Supplier Device Package: 0402; Features: Moisture Resistant; Tolerance: ±5%; Operating Temperature: -55°C ~ 155°C; Size / Dimension: 0.039" L x 0.020" W (1.00mm x 0.50mm); Package / Case: 0402 (1005 Metric)
SW1 = SW_SM_4bit_v2: Part Description: Dip Switch SPST Position Through Hole, Right Angle Piano Actuator 25mA 24VDC; Manufacturer: CUI Devices; Manufacturer Part Number 1: DS02C-254-1L-04BE; Supplier 1: Digi-Key; Supplier Part Number 1: 2223-DS02C-254-1L-04BE-ND; Stock 1: 1133; Pricing 1: 1=0,60000, 10=0,58100, 25=0,55920, 100=0,48400, 250=0,44100, 500=0,40874, 1000=0,36572, 2500=0,34636, 5000=0,32054 (USD); RoHS: Yes
VT2 = NDS331N: Manufacturer Part Number: DMN6140L-13; Manufacturer: Diodes Incorporated; Part Description: N-Channel 60V 1.6A (Ta) 700mW (Ta) Surface Mount SOT-23; Power Dissipation (Max): 700mW (Ta); Vgs (Max): ±20V; Current - Continuous Drain (Id) @ 25°C: 1.6A (Ta); FET Type: N-Channel; Rds On (Max) @ Id, Vgs: 140 mOhm @ 1.8A, 10V; Vgs(th) (Max) @ Id: 3V @ 250µA; Drive Voltage (Max Rds On,  Min Rds On): 4.5V, 10V; FET Feature: -; Supplier Device Package: SOT-23; Supplier Part Number 1: DMN6140L-13DICT-ND; RoHS: RoHS Compliant; Technology: MOSFET (Metal Oxide); Package / Case: TO-236-3, SC-59, SOT-23-3; Mounting Type: Surface Mount; Packaging: Cut Tape (CT); Category: Discrete Semiconductor Products; Supplier 1: Digi-Key; Operating Temperature: -55°C ~ 150°C (TJ); Part Status: Active; Value: DMN6140L; Manufacturer Part Number 1: DMN6140L-13